# EAGLE schematic SIM808 (EAGLE 7.4.0)
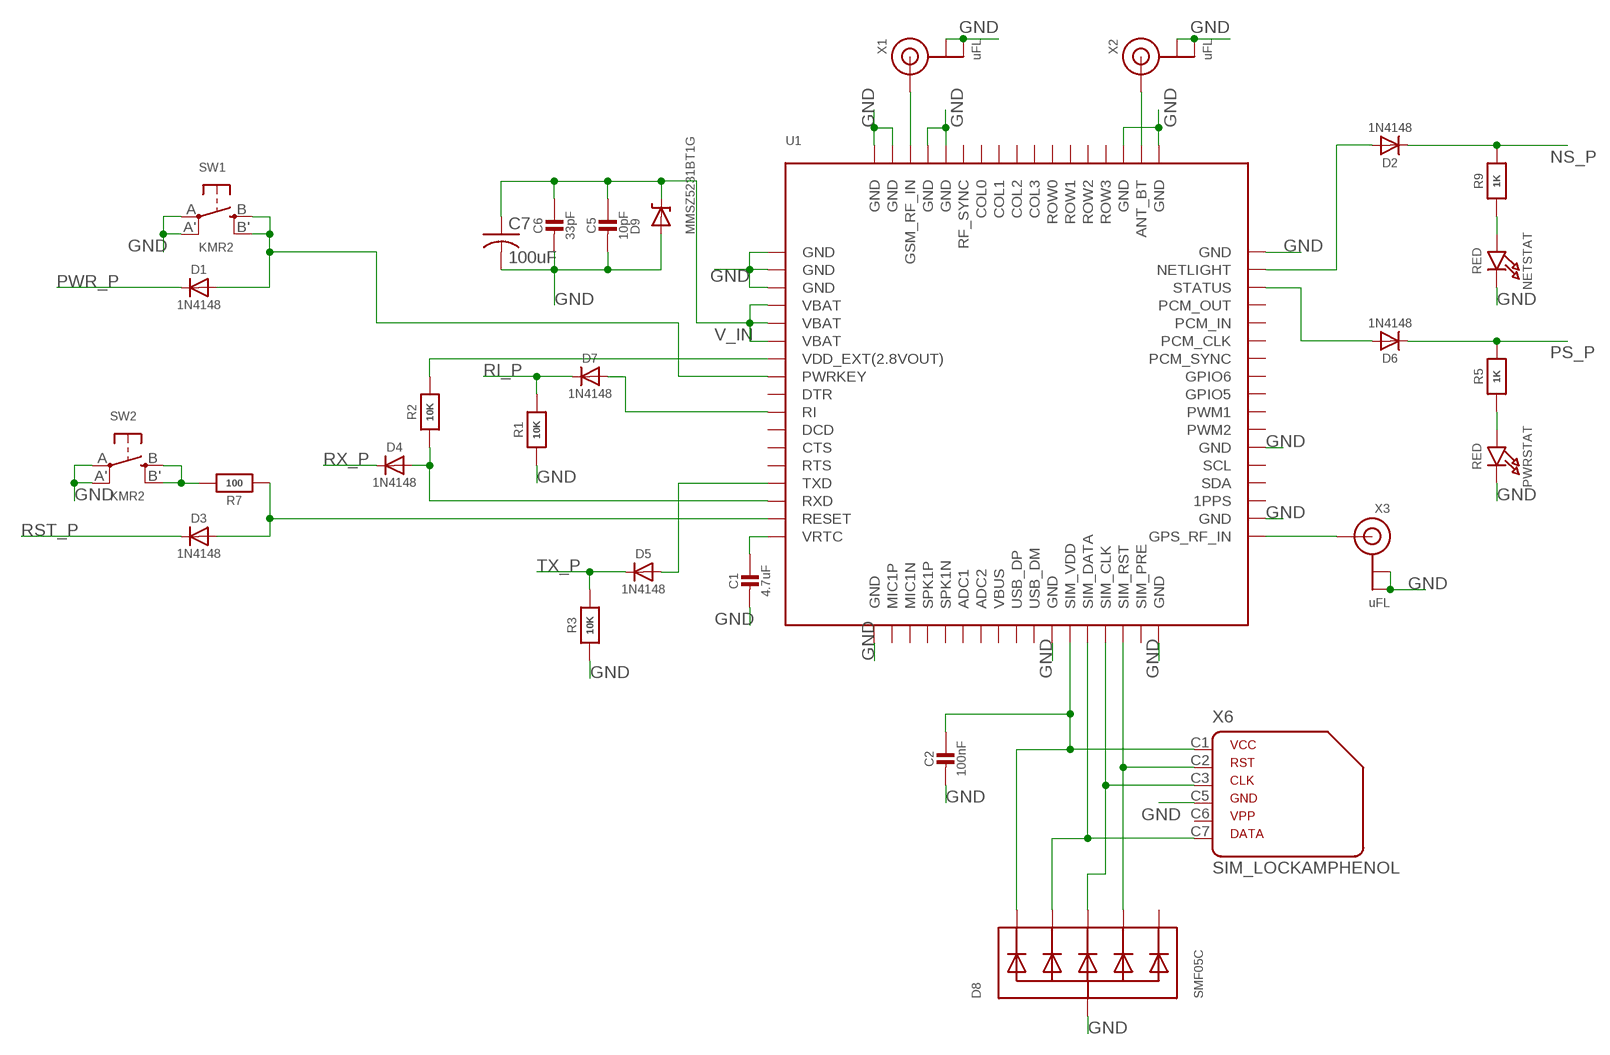
[diagram p0: schematic, sheet 1]

## Parts
C1  4.7uF  CAP_CERAMIC0805-NOOUTLINE  [0805-NO]
C2  100nF  CAP_CERAMIC0805-NOOUTLINE  [0805-NO]
C5  10pF  CAP_CERAMIC0805-NOOUTLINE  [0805-NO]
C6  33pF  CAP_CERAMIC0805-NOOUTLINE  [0805-NO]
C7  100uF  C-USC1210  [C1210]
D1  1N4148  DIODESOD-323  [SOD-323]
D2  1N4148  DIODESOD-323  [SOD-323]
D3  1N4148  DIODESOD-323  [SOD-323]
D4  1N4148  DIODESOD-323  [SOD-323]
D5  1N4148  DIODESOD-323  [SOD-323]
D6  1N4148  DIODESOD-323  [SOD-323]
D7  1N4148  DIODESOD-323  [SOD-323]
D8  SMF05C  TVSARRAY_5LANE  [SOT363]
D9  MMSZ5231BT1G  DIODE-ZENERSOD123  [SOD-123]
NETSTAT  RED  LED0805_NOOUTLINE  [CHIPLED_0805_NOOUTLINE]
PWRSTAT  RED  LED0805_NOOUTLINE  [CHIPLED_0805_NOOUTLINE]
R1  10K  RESISTOR0805_NOOUTLINE  [0805-NO]
R2  10K  RESISTOR0805_NOOUTLINE  [0805-NO]
R3  10K  RESISTOR0805_NOOUTLINE  [0805-NO]
R5  1K  RESISTOR0805_NOOUTLINE  [0805-NO]
R7  100  RESISTOR0805_NOOUTLINE  [0805-NO]
R9  1K  RESISTOR0805_NOOUTLINE  [0805-NO]
SW1  KMR2  SWITCH_TACT_SMT4.6X2.8  [BTN_KMR2_4.6X2.8]
SW2  KMR2  SWITCH_TACT_SMT4.6X2.8  [BTN_KMR2_4.6X2.8]
U1  GSM_SIM808_LITERAL  [SIM900_SMT]
X1  uFL  ANTENNA_U.FL  [U.FL]
X2  uFL  ANTENNA_U.FL  [U.FL]
X3  uFL  ANTENNA_U.FL  [U.FL]
X6  SIM_LOCKAMPHENOL  [C707_10M006_512_2]

## Nets
GND: C1.2 C2.2 C5.2 C6.2 C7.2 D8.2(A) D9.A NETSTAT.C PWRSTAT.C R1.1 R3.1 SW1.A'(P1) SW1.A(P) SW2.A'(P1) SW2.A(P) U1.P$1(GND) U1.P$2(GND) U1.P$3(GND) U1.P$18(GND) U1.P$28(GND) U1.P$34(GND) U1.P$36(GND) U1.P$40(GND) U1.P$51(GND) U1.P$52(GND) U1.P$54(GND) U1.P$64(GND) U1.P$65(GND) U1.P$67(GND) U1.P$68(GND) X1.1(GND) X1.2(GND) X2.1(GND) X2.2(GND) X3.1(GND) X3.2(GND) X6.C5
N$1: C1.1 U1.P$17(VRTC)
N$2: D7.A U1.P$10(RI)
N$3: U1.P$35(GPS_RF_IN) X3.3(SIGNAL)
N$4: X2.3(SIGNAL)
N$5: R2.2 U1.P$7(VDD_EXT(2.8VOUT))
N$6: D4.A R2.1 U1.P$15(RXD)
N$8: D5.A U1.P$14(TXD)
N$11: PWRSTAT.A R5.1
N$13: D8.5(C4) U1.P$32(SIM_RST) X6.C2
N$14: D8.4(C3) U1.P$31(SIM_CLK) X6.C3
N$15: C2.1 D8.1(C1) U1.P$29(SIM_VDD) X6.C1
N$16: U1.P$66(GSM_RF_IN) X1.3(SIGNAL)
N$17: D8.3(C2) U1.P$30(SIM_DATA) X6.C7
N$18: NETSTAT.A R9.1
NS: D2.A U1.P$50(NETLIGHT)
NS_P: D2.C R9.2
PS: D6.A U1.P$49(STATUS)
PS_P: D6.C R5.2
PWR_P: D1.C
PWRKEY: D1.A SW1.B'(S1) SW1.B(S) U1.P$8(PWRKEY)
PWRKEY2: R7.2 SW2.B'(S1) SW2.B(S)
RI_P: D7.C R1.2
RST: D3.A R7.1 U1.P$16(RESET)
RST_P: D3.C
RX_P: D4.C
TX_P: D5.C R3.2
V_IN: C5.1 C6.1 C7.1 D9.C U1.P$4(VBAT) U1.P$5(VBAT) U1.P$6(VBAT)
Unconnected: D8.6(C5) U1.P$9(DTR) U1.P$11(DCD) U1.P$12(CTS) U1.P$13(RTS) U1.P$19(MIC1P) U1.P$20(MIC1N) U1.P$21(SPK1P) U1.P$22(SPK1N) U1.P$23(ADC1) U1.P$24(ADC2) U1.P$26(USB_DP) U1.P$27(USB_DM) U1.P$33(SIM_PRE) U1.P$37(1PPS) U1.P$38(SDA) U1.P$39(SCL) U1.P$41(PWM2) U1.P$42(PWM1) U1.P$43(GPIO5) U1.P$44(GPIO6) U1.P$45(PCM_SYNC) U1.P$46(PCM_CLK) U1.P$47(PCM_IN) U1.P$48(PCM_OUT) U1.P$53(ANT_BT) U1.P$55(ROW3) U1.P$56(ROW2) U1.P$57(ROW1) U1.P$58(ROW0) U1.P$59(COL3) U1.P$60(COL2) U1.P$61(COL1) U1.P$62(COL0) U1.P$63(RF_SYNC) X6.C6

## Power pins joined to a net without a drawn wire
VBUS: U1.P$25(VBUS)

## Library data of the parts
C1 C2 C5 C6 = microbuilder:CAP_CERAMIC: Ceramic Capacitors For new designs, use the packages preceded by an '_' character since they are more reliable: The following footprints should be used on most boards: _0402 - Standard footprint for regular board layouts _0603 - Standard footprint for regular board layouts _0805 - Standard footprint for regular board layouts _1206 - Standard footprint for regular board layouts For extremely tight-pitch boards where space is at a premium, the following 'micro-pitch' footprints can be used (smaller pads, no silkscreen outline, etc.): _0402MP - Micro-pitch footprint for very dense/compact boards _0603MP - Micro-pitch footprint for very dense/compact boards _0805MP - Micro-pitch footprint for very dense/compact boards _1206MP - Micro-pitch footprint for very dense/compact boards
C7 = rcl:C-US: CAPACITOR, American symbol
D1-D7 = microbuilder:DIODE: Diode SMA Model Volts Amps Type Vf Ir Digikey # Notes SSA34-E3 40V 3A Schottky 480mV @ 3A 200uA @ 40V SSA34-E3/61TGITR-ND CDBA120-G 20V 1A Schottky 500mV @ 1A 500uA @ 20V 641-1014-6-ND REEL MBRA210 10V 2A Schottky 350mV @ 2A 700uA @ 10V MBRA210LT3 SOD-123 Model Volts Amps Type Vf Ir Order # Notes BAT54T1G 30V 200mA Schottky 800mV @ 200mA 2uA @ 25V BAT54T1GOSTR-ND B0530W 30V 500mA Schottky 430mV @ 500mA 130uA @ 30V B0530W-FDICT-ND REEL MBR120 20V 1A Schottky 340mV @ 1A MBR120VLSFT1GOSCT-ND SOD-323 Model Volts Amps Type Vf Ir Order # Notes PMEG2005EJ 20V 500mA Schottky 355mV @ 500mA 568-4110-1-ND ZLLS410 10V 570mA Schottky 380mV @ 570mA ZLLS410CT-ND 1N4148WS 75V 150mA Silicon/Simple 1V 1N4148WSFSCT-ND REEL SOD-523 Model Volts Amps Type Vf Ir Order # Notes BAT54XV2 30V 200mA Schottky 0.8V @ 100mA BAT54XV2CT-ND TB751S 30V 30mA Schottky RB751S-40TE61CT-ND SOT23-R/W (R = Solder Paste/Reflow Ovens, W = Hand-Soldering) Model Volts Amps Type Vf Ir Order # Notes BAT54FILM 40V 300mA Schottky 497-7162-1-ND POWERDI-5 Model Volts Amps Type Vf Ir Order # Notes PDS560 60V 5A Schottky 670mV @ 5A 150uA @ 60V PDS560DICT-ND
D8 = microbuilder:TVSARRAY_5LANE: Voltage Transient Suppressor Array SOT363 SMF05C - 100W 5V: Digikey - SMF05CT1GOSCT-ND
D9 = microbuilder:DIODE-ZENER: Zener Diode SMA: 30V 1W Zener Diode, 1.2Vf - Digikey: SMAZ30-FDICT-ND
NETSTAT PWRSTAT = microbuilder:LED: LED 0603 - 0603 Surface Mount Package 2mA: Green LED - Low Power (3.9mcd, 2ma, 1.7Vf) - Digikey: 475-2709-2-ND Orange LED - Low Power (9.8mcd, 2ma, 1.8Vf) - Digikey: 475-1194-2-ND Red LED - Low Power (5mcd, 2ma, 1.8Vf) - Digikey: 475-1195-2-ND Yellow LED - Low Power (7mcd, 2ma, 1.8Vf) - Digikey: 475-1196-2-ND 5mA: Blue LED - Low Power (17mcd, 5ma, 2.9Vf) - Digikey: LNJ937W8CRACT-ND 0805 - 0805 Surface Mount Package 2mA: Red LED (8.8mcd, 2mA, 1.8Vf, Clear) - Low Power [Digikey: 475-2510-1-ND] Green LED (5mcd, 2mA, 1.8Vf, Clear) - Low Power [Digikey: 475-2730-1-ND] Yellow LED (11.3mcd, 2mA, 1.8Vf, Clear) - Low Power [Digikey: 475-2555-1-ND] 20mA: Red LED (104mcd, 20mA, Diffused) - LS R976 [Digikey: 475-1278-6-ND] Red LED (12mcd, 20mA, 2.0Vf, Clear) - APT2012EC [Digikey: 754-1128-1-ND] Green LED (15mcd, 20mA, 2.2Vf, Clear) - APT2012GC [Digikey: 754-1131-1-ND] Orange LED (160mcd, 20mA, 2.1Vf, Clear) - APT2012SECK [Digikey: 754-1130-1-ND] 1206 - 1206 Surface Mount Package Green LED (26mcd, 20mA, Diffused) - LG N971 [Digikey: 475-1407-6-ND] Red LED (15mcd, 20mA, Diffused) - LH N974 [Digikey: 475-1416-6-ND] Cree - Cree High-Power Surface Mount LEDs XPEBWT-L1-0000-00D50 - White 111lm 350mA 2.9Vf 6200K 110° XTEAWT-00-0000-00000LEE3 - White 114lm 350mA 2.85Vf 5000K 115° Everlight - Everlight 45-21 Series Surface Mount LEDs 45-21/QK2C-B2832AC2CB2/2T - Warm White 2000mcd 20mA 3.25Vf 3050K 120° 45-21/LK2C-B38452C4CB2/2T - Nuetral White 2000mcd 20mA 3.25Vf 4150K 120° 45-21/LK2C-B50634C6CB2/2T - Cold White 2200mcd 20mA 3.25Vf 5650K 120° PLCC2 Reverse Mount LS T77K-J1L2-1-0-2-R18-Z - Red 11.25mcd 2mA 1.8Vf 630nm 120° LO T77K-L1M2-24-Z - Orange 19.6mcd 2mA 1.8Vf 606nm 120° LY T77K-K2M1-26-Z - Yellow 15.7mcd 2mA 1.8Vf 587nm 120°
R1-R3 R5 R7 R9 = microbuilder:RESISTOR: Resistors For new designs, use the packages preceded by an '_' character since they are more reliable: The following footprints should be used on most boards: _0402 - Standard footprint for regular board layouts _0603 - Standard footprint for regular board layouts _0805 - Standard footprint for regular board layouts _1206 - Standard footprint for regular board layouts For extremely tight-pitch boards where space is at a premium, the following 'micro-pitch' footprints can be used (smaller pads, no silkscreen outline, etc.): _0402MP - Micro-pitch footprint for very dense/compact boards _0603MP - Micro-pitch footprint for very dense/compact boards _0805MP - Micro-pitch footprint for very dense/compact boards _1206MP - Micro-pitch footprint for very dense/compact boards
SW1 SW2 = microbuilder:SWITCH_TACT_SMT: SMT Tact Switches 6x6mm - Digikey: P12940SCT-ND KMR2 (4.6x2.8mm) - Digikey: 401-1426-1-ND EVQ-PQHB55 - Light Touch, 160GF (4.5x4.5mm) - Digikey: P8090SCT-ND KMT0 - KMT021 NGJ LHS (etc.) IP68/Waterproof - Digikey: CKN10289CT-ND
U1 = adafruit:GSM_SIM808_LITERAL: SIM808 GSM Module
X1-X3 = microbuilder:ANTENNA_U.FL: U.FL Antenna Connector
X6 = microbuilder:SIM_LOCK: C707A SIMLOCK® 2.5 mm with wide solder tails Source: Data sheet <http://www.amphenol.info/downloads/C707_10M006_512_2.pdf>; OC_FARNELL: unknown; OC_NEWARK: unknown